# EAGLE schematic V0p2_Main_PCB2 (EAGLE 7.3.0)
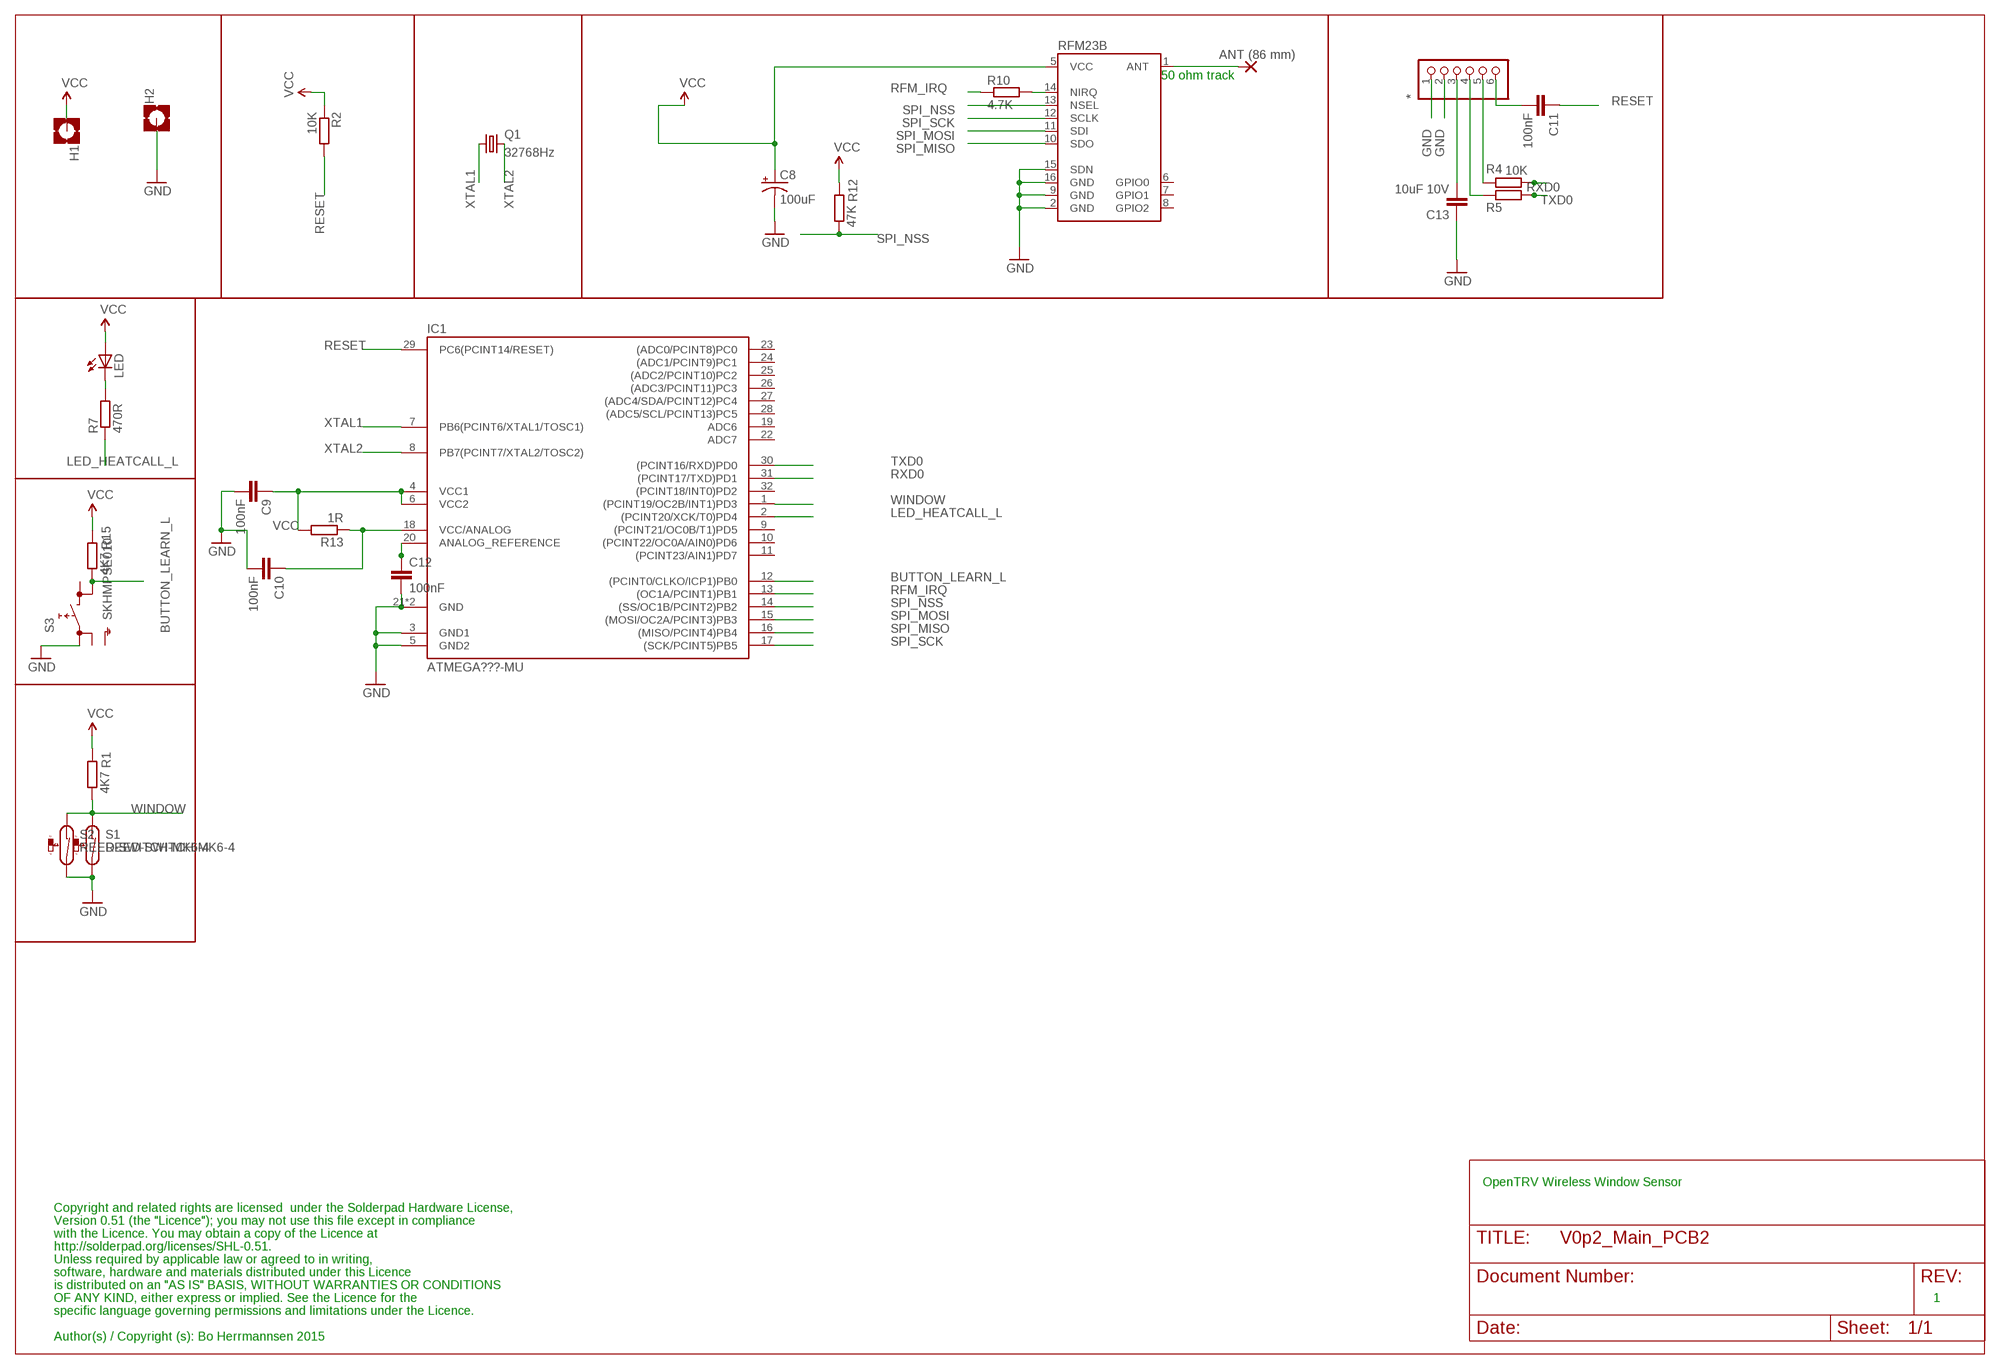
[diagram p0: schematic, sheet 1]

## Parts
*  PINHD-1X6  [1X06]
ANT1  ANT (86 mm)  2,15/1,0  [2,15/1,0]
C8  100uF  CAP_POL1206  [EIA3216]
C9  100nF  C-EUC0402  [C0402]
C10  100nF  C-EUC0402  [C0402]
C11  100nF  C-EUC0402  [C0402]
C12  100nF  C-EUC0402  [C0402]
C13  10uF 10V  C-EUC0402  [C0402]
H1  MOUNT-PAD-SQUARE2.8  [2,8-PAD-SQUARE]
H2  MOUNT-PAD-SQUARE2.8  [2,8-PAD-SQUARE]
IC1  ATMEGA???-MU  ATMEGA8-MU  [MLF32]
LED  LEDCHIPLED_0603  [CHIPLED_0603]
Q1  32768Hz  MC-306  [MC-306]
R1  4K7  R-EU_R0402  [R0402]
R2  10K  R-EU_R0402  [R0402]
R4  10K  R-EU_R0402  [R0402]
R5  10K  R-EU_R0402  [R0402]
R7  470R  R-EU_R0402  [R0402]
R10  4.7K  R-EU_R0402  [R0402]
R12  47K  R-EU_R0402  [R0402]
R13  1R  R-EU_R0402  [R0402]
R15  4K7  R-EU_R0402  [R0402]
RFM23B  RFM23B  [RFM23-XXX-S1]
S1  REED-SWITCH-MK6-4  [MK6-4]
S2  REED-SWITCH-MK6-4  [MK6-4]
S3  SKHMPSE010  [SKHMPXE010]

## Nets
BUTTON_LEARN_L: IC1.12((PCINT0/CLKO/ICP1)PB0) R15.1 S3.4(2.2)
GND [supply]: *.1 *.2 C8.C(-) C9.2 C10.2 C12.2 C13.1 H2.B2,8(MOUNT) IC1.3(GND1) IC1.5(GND2) IC1.21(GND) IC1.P$1(GND) RFM23B.2(GND) RFM23B.9(GND) RFM23B.15(SDN) RFM23B.16(GND) S1.2 S2.2 S3.1(1.1)
LED_HEATCALL_L: IC1.2((PCINT20/XCK/T0)PD4) R7.1
N$1: *.6 C11.2
N$3: *.4 R5.2
N$5: *.5 R4.2
N$6 [supply]: C12.1 IC1.20(ANALOG_REFERENCE)
N$7: R10.2 RFM23B.14(NIRQ)
N$8: C10.1 IC1.18(VCC/ANALOG) R13.1
N$11 [supply]: *.3 C13.2
N$13: LED.C R7.2
N$31 [ant]: ANT1.1(P) RFM23B.1(ANT)
RESET: C11.1 IC1.29(PC6(PCINT14/RESET)) R2.2
RFM_IRQ: IC1.13((OC1A/PCINT1)PB1) R10.1
RXD0: IC1.31((PCINT17/TXD)PD1) R4.1
SPI_MISO: IC1.16((MISO/PCINT4)PB4) RFM23B.10(SDO)
SPI_MOSI: IC1.15((MOSI/OC2A/PCINT3)PB3) RFM23B.11(SDI)
SPI_NSS: IC1.14((SS/OC1B/PCINT2)PB2) R12.1 RFM23B.13(NSEL)
SPI_SCK: IC1.17((SCK/PCINT5)PB5) RFM23B.12(SCLK)
TXD0: IC1.30((PCINT16/RXD)PD0) R5.1
VCC [supply]: C8.A(+) C9.1 H1.B2,8(MOUNT) IC1.4(VCC1) IC1.6(VCC2) LED.A R1.2 R2.1 R12.2 R13.2 R15.2 RFM23B.5(VCC)
WINDOW: IC1.1((PCINT19/OC2B/INT1)PD3) R1.1 S1.1 S2.1
XTAL1: IC1.7(PB6(PCINT6/XTAL1/TOSC1)) Q1.1
XTAL2: IC1.8(PB7(PCINT7/XTAL2/TOSC2)) Q1.4
Unconnected: IC1.9((PCINT21/OC0B/T1)PD5) IC1.10((PCINT22/OC0A/AIN0)PD6) IC1.11((PCINT23/AIN1)PD7) IC1.19(ADC6) IC1.22(ADC7) IC1.23((ADC0/PCINT8)PC0) IC1.24((ADC1/PCINT9)PC1) IC1.25((ADC2/PCINT10)PC2) IC1.26((ADC3/PCINT11)PC3) IC1.27((ADC4/SDA/PCINT12)PC4) IC1.28((ADC5/SCL/PCINT13)PC5) IC1.32((PCINT18/INT0)PD2) RFM23B.6(GPIO0) RFM23B.7(GPIO1) RFM23B.8(GPIO2) S3.2(1.2) S3.3(2.1) S3.5(SH)

## Notes on the sheet
- 50 ohm track
- OpenTRV Wireless Window Sensor
- Copyright and related rights are licensed  under the Solderpad Hardware License,
- Version 0.51 (the "Licence"); you may not use this file except in compliance
- with the Licence. You may obtain a copy of the Licence at
- http://solderpad.org/licenses/SHL-0.51.
- Unless required by applicable law or agreed to in writing,
- software, hardware and materials distributed under this Licence
- is distributed on an "AS IS" BASIS, WITHOUT WARRANTIES OR CONDITIONS
- OF ANY KIND, either express or implied. See the Licence for the | 1
- specific language governing permissions and limitations under the Licence.
- Author(s) / Copyright (s): Bo Herrmannsen 2015

## Library data of the parts
* = adafruit:PINHD-1X6: PIN HEADER
ANT1 = wirepad:2,15/1,0: THROUGH-HOLE PAD
C8 = SparkFun-Passives:CAP_POL: Capacitor Polarized These are standard SMD and PTH capacitors. Normally 10uF, 47uF, and 100uF in electrolytic and tantalum varieties. Always verify the external diameter of the through hole cap, it varies with capacity, voltage, and manufacturer. The EIA devices should be standard.
C9-C13 = resistor:C-EU: CAPACITOR, European symbol
H1 H2 = holes:MOUNT-PAD-SQUARE: MOUNTING PAD, square
IC1 = Arduino-AVR:ATMEGA8
LED = led:LED: LED OSRAM: - CHIPLED LG R971, LG N971, LY N971, LG Q971, LY Q971, LO R971, LY R971 LH N974, LH R974 LS Q976, LO Q976, LY Q976 LO Q996 - Hyper CHIPLED LW Q18S LB Q993, LB Q99A, LB R99A - SideLED LS A670, LO A670, LY A670, LG A670, LP A670 LB A673, LV A673, LT A673, LW A673 LH A674 LY A675 LS A676, LA A676, LO A676, LY A676, LW A676 LS A679, LY A679, LG A679 - Hyper Micro SIDELED® LS Y876, LA Y876, LO Y876, LY Y876 LT Y87S - SmartLED LW L88C, LW L88S LB L89C, LB L89S, LG L890 LS L89K, LO L89K, LY L89K LS L896, LA L896, LO L896, LY L896 - TOPLED LS T670, LO T670, LY T670, LG T670, LP T670 LSG T670, LSP T670, LSY T670, LOP T670, LYG T670 LG T671, LOG T671, LSG T671 LB T673, LV T673, LT T673, LW T673 LH T674 LS T676, LA T676, LO T676, LY T676, LB T676, LH T676, LSB T676, LW T676 LB T67C, LV T67C, LT T67C, LS T67K, LO T67K, LY T67K, LW E67C LS E67B, LA E67B, LO E67B, LY E67B, LB E67C, LV E67C, LT E67C LW T67C LS T679, LY T679, LG T679 LS T770, LO T770, LY T770, LG T770, LP T770 LB T773, LV T773, LT T773, LW T773 LH T774 LS E675, LA E675, LY E675, LS T675 LS T776, LA T776, LO T776, LY T776, LB T776 LHGB T686 LT T68C, LB T68C - Hyper Mini TOPLED® LB M676 - Mini TOPLED Santana® LG M470 LS M47K, LO M47K, LY M47K Source: http://www.osram.convergy.de LUXEON: - LUMILED® LXK2-PW12-R00, LXK2-PW12-S00, LXK2-PW14-U00, LXK2-PW14-V00 LXK2-PM12-R00, LXK2-PM12-S00, LXK2-PM14-U00 LXK2-PE12-Q00, LXK2-PE12-R00, LXK2-PE12-S00, LXK2-PE14-T00, LXK2-PE14-U00 LXK2-PB12-K00, LXK2-PB12-L00, LXK2-PB12-M00, LXK2-PB14-N00, LXK2-PB14-P00, LXK2-PB14-Q00 LXK2-PR12-L00, LXK2-PR12-M00, LXK2-PR14-Q00, LXK2-PR14-R00 LXK2-PD12-Q00, LXK2-PD12-R00, LXK2-PD12-S00 LXK2-PH12-R00, LXK2-PH12-S00 LXK2-PL12-P00, LXK2-PL12-Q00, LXK2-PL12-R00 Source: www.luxeon.com KINGBRIGHT: KA-3528ASYC Source: www.kingbright.com
Q1 = crystal:MC-306: kHz RANGE CRYSTAL UNIT SMD Source: MC-306_405_406_E07X.PDF Homepage <http://www.epsontoyocom.co.jp>; MPN: MC-306 60.0KHZ 100PPM ,12.5PF; OC_FARNELL: 1278040; OC_NEWARK: 31M5576
R1 R2 R4 R5 R7 R10 R12 R13 R15 = resistor:R-EU_: RESISTOR, European symbol
RFM23B = SparkFun-RF:RFM23B
S1 S2 = switch-reed:REED-SWITCH-: Reed Sensor; OC_FARNELL: unknown
S3 = switch:SKHMP*E010: 6.2 X 6.5mm TACT Switch (SMD) Source: http://www3.alps.co.jp/WebObjects/catalog.woa/PDF/E/Switch/Tact/SKHM/SKHM.PDF

## Net classes
0 default: width 0.203 mm
1 supply: width 0.406 mm, clearance 0.203 mm
2 ant: width 2.184 mm